# Altium project AS608-small.PrjPcb
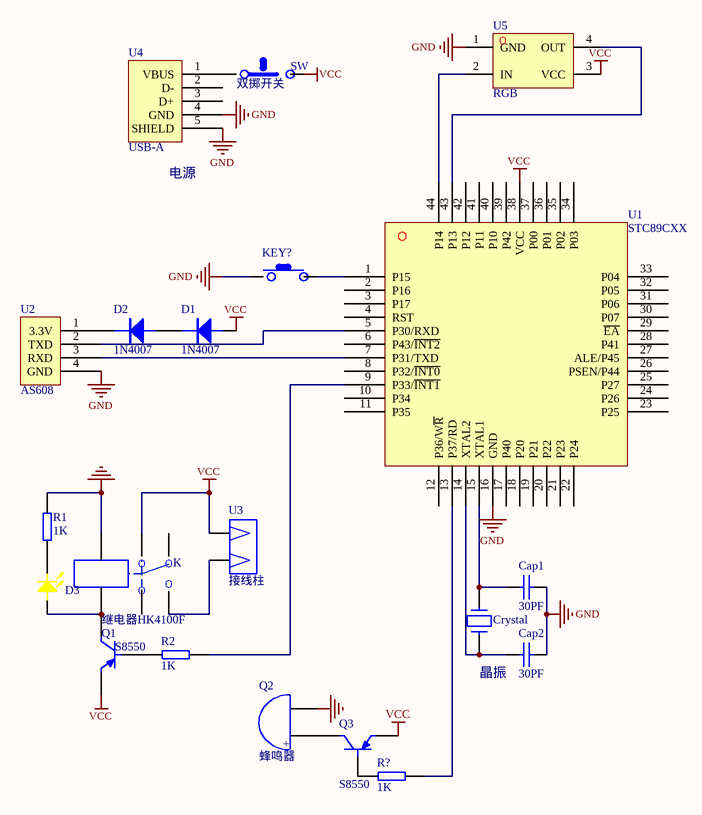
[diagram p0: AS608-small.SchDoc]
1 sheet, 20 parts. Net scope: global (net labels, ports and power ports of the same name join across sheets).
Board file: PCB2.PcbDoc

## Sheet AS608-small.SchDoc
size A4

### Parts
1k  1K  [0805R]
Cap1  30PF  [0805C]
Cap2  30PF  [0805C]
Crystal  11.0592MHZ  [XTAL]  (value not drawn)
D1  1N4007  [SMA(DO-214AC)_S3]
D2  1N4007  [SMA(DO-214AC)_S3]
D3  LED-YELLOW  [0805D]  (value not drawn)
K  继电器HK4100F  [HK4100F]
KEY  功能按键  [SW5*5]  (value not drawn)
Q1  S8550  [三极管]
Q2  蜂鸣器  [蜂鸣器]
Q3  S8550  [三极管]
R1  1K  [0805R]
R2  1K  [0805R]
SW  双掷开关  [SS12D07G5]
U1  STC89CXX  [LQFP44]
U2  AS608  [XH4P]
U3  接线柱  [XH2P]
U4  USB-A  [USB-A贴片]
U5  RGB  [WS2812RGB]

### Nets
GND: Cap1.1 Cap2.1 K.5 KEY.1 Q2.2 R1.1 U1.16(GND) U2.4(GND) U4.4(GND) U4.5(SHIELD) U5.1(GND)
VCC: D1.1 K.6 Q1.1(E) Q3.1(E) SW.2 U1.38(VCC) U3.2 U5.3(VCC)
Net1k_1: 1k.1 Q3.2(B)
Net1k_2: 1k.2 U1.13(P37/RD)
NetCap1_2: Cap1.2 Crystal.1 U1.15(XTAL1)
NetCap2_2: Cap2.2 Crystal.2 U1.14(XTAL2)
NetD1_2: D1.2 D2.1
NetD2_2: D2.2 U2.1(3.3V)
NetD3_1: D3.1 K.2 Q1.3(C)
NetD3_2: D3.2 R1.2
NetK_4: K.4 U3.1
NetKEY_2: KEY.2 U1.1(P15)
NetQ1_2: Q1.2(B) R2.1
NetQ2_1: Q2.1 Q3.3(C)
NetR2_2: R2.2 U1.9(P33/~{INT1})
NetSW_1: SW.1 U4.1(VBUS)
NetU1_5: U1.5(P30/RXD) U2.2(TXD)
NetU1_7: U1.7(P31/TXD) U2.3(RXD)
NetU1_43: U1.43(P13) U5.4(OUT)
NetU1_44: U1.44(P14) U5.2(IN)

Not connected (* = marked no-connect by the designer): K 1 3; U1 2(P16) 3(P17) 4(RST) 6(P43/~{INT2}) 8(P32/~{INT0}) 10(P34) 11(P35) 12(P36/W~{R}) 17(P40) 18(P20) 19(P21) 20(P22) 21(P23) 22(P24) 23(P25) 24(P26) 25(P27) 26(PSEN/P44) 27(ALE/P45) 28(P41) 29(~{EA}) 30(P07) 31(P06) 32(P05) 33(P04) 34(P03) 35(P02) 36(P01) 37(P00) 39(P42) 40(P10) 41(P11) 42(P12); U4 2(D-) 3(D+)

### Notes on the sheet
- (near U4) 电源
- 晶振
- (in symbol 蜂鸣器) +

### Library data of the parts
1k R1 R2 = RES
Cap1 Cap2 = 瓷片电容
Crystal = XTAL
KEY = 微动开关
U5 = WS2812RGB